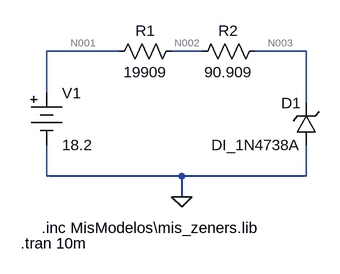
[diagram p0: schematic Zener1N4738ValoresNoComercialesCaso2.asc]
Zener1N4738ValoresNoComercialesCaso2.asc, the LTspice schematic file:
Version 4.1
SHEET 1 880 680
WIRE 160 80 48 80
WIRE 288 80 240 80
WIRE 448 80 368 80
WIRE 48 144 48 80
WIRE 448 160 448 80
WIRE 48 272 48 224
WIRE 256 272 48 272
WIRE 448 272 448 224
WIRE 448 272 256 272
WIRE 256 304 256 272
FLAG 256 304 0
SYMBOL Misc\\battery 48 128 R0
SYMATTR InstName V1
SYMATTR Value 18.2
SYMBOL res 256 64 R90
WINDOW 0 0 56 VBottom 2
WINDOW 3 32 56 VTop 2
SYMATTR InstName R1
SYMATTR Value 19909
SYMBOL res 384 64 R90
WINDOW 0 0 56 VBottom 2
WINDOW 3 32 56 VTop 2
SYMATTR InstName R2
SYMATTR Value 90.909
SYMBOL zener 464 224 R180
WINDOW 0 24 64 Left 2
WINDOW 3 24 0 Left 2
SYMATTR InstName D1
SYMATTR Value DI_1N4738A
SYMATTR Prefix x
TEXT 40 352 Left 2 !.inc MisModelos\\mis_zeners.lib
TEXT 8 376 Left 2 !.tran 10m

The netlist it stands for:
* Zener1N4738ValoresNoComercialesCaso2.asc
V1 N001 0 18.2
R1 N002 N001 19909
R2 N003 N002 90.909
X§D1 0 N003 DI_1N4738A  ; pins + -
.inc MisModelos\mis_zeners.lib
.tran 10m
.backanno
.end

* Results of the author's LTspice run, read from the files saved beside the schematic
* Operating Point, zero values left out:
*   V(n001) = 18.2 V
*   V(n002) = 8.109 V
*   V(n003) = 8.063 V
*   I(R1) = -506.8 µA
*   I(R2) = -506.8 µA
*   I(V1) = -506.8 µA
*   Ix(d1:1) = -506.8 µA
*   Ix(d1:2) = 506.8 µA